# Altium schematic sheet LCD.SchDoc
size A4; Author: Khanh BK; Organization: DB Bach Khoa HN; Address1: Bach Khoa- HBT - HN; Address2: khanh.db192932; Address3: Youtube: Đào Bá Khánh; Address4: 0357698570; Revision: 1.0Ver; SheetNumber: 3; SheetTotal: 6
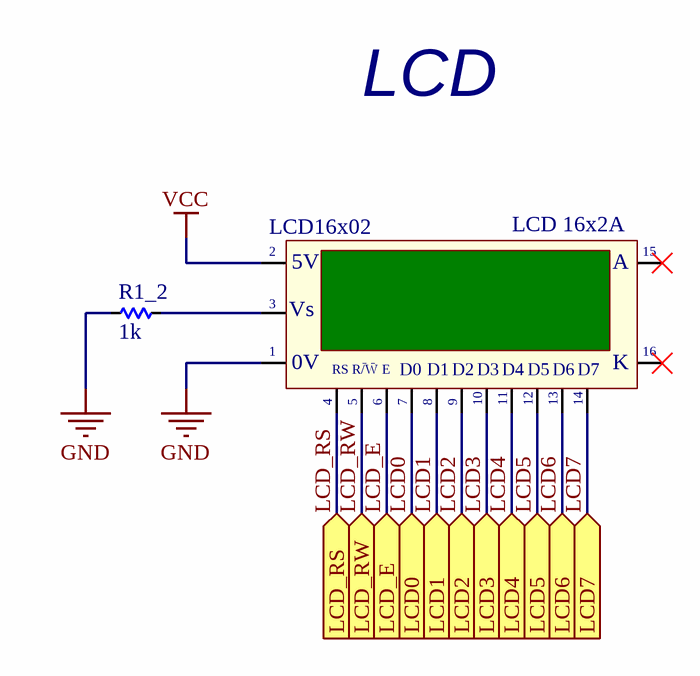
[diagram p0: LCD.SchDoc]

## Parts
LCD16x02  LCD 16x2A  [LCD16X2]
R1_2  1k  [RES-SMD-0805]

## Ports
LCD0 (in), LCD1 (in), LCD2 (in), LCD3 (in), LCD4 (in), LCD5 (in), LCD6 (in), LCD7 (in), LCD_E (in), LCD_RS (in), LCD_RW (in)

## Nets
GND: LCD16x02.1(GND) R1_2.2
VCC: LCD16x02.2(VDD)
LCD0: LCD16x02.7(D0) ; port LCD0
LCD1: LCD16x02.8(D1) ; port LCD1
LCD2: LCD16x02.9(D2) ; port LCD2
LCD3: LCD16x02.10(D3) ; port LCD3
LCD4: LCD16x02.11(D4) ; port LCD4
LCD5: LCD16x02.12(D5) ; port LCD5
LCD6: LCD16x02.13(D6) ; port LCD6
LCD7: LCD16x02.14(D7) ; port LCD7
LCD_E: LCD16x02.6(~{EN}) ; port LCD_E
LCD_RS: LCD16x02.4(RS) ; port LCD_RS
LCD_RW: LCD16x02.5(R/~{W}) ; port LCD_RW
NetLCD16x02_3: LCD16x02.3(VEE) R1_2.1

Not connected (* = marked no-connect by the designer): LCD16x02 15(A)* 16(K)*

## Notes on the sheet
- LCD
- Title
- Size:
- Date:
- Author:
- A4
- Time:
- Number:
- Checked:
- Revision:
- Sheet
- Approved:
- of
- File:
- (in symbol LCD16x2A) 5V; Vs; |; 0V; R/W; E

## Library data of the parts
LCD16x02 = LCD16x2A: LCD dipslay 16 char, 2 line; Value: LCD16x2A
R1_2 = Res-SMD: Resistor; Manufacturer: Generic Components; Class: Passive; Published: 08/06/2000; Publisher: Altium Hobart Technology Centre